# EAGLE schematic matrixblock (EAGLE 6.4)
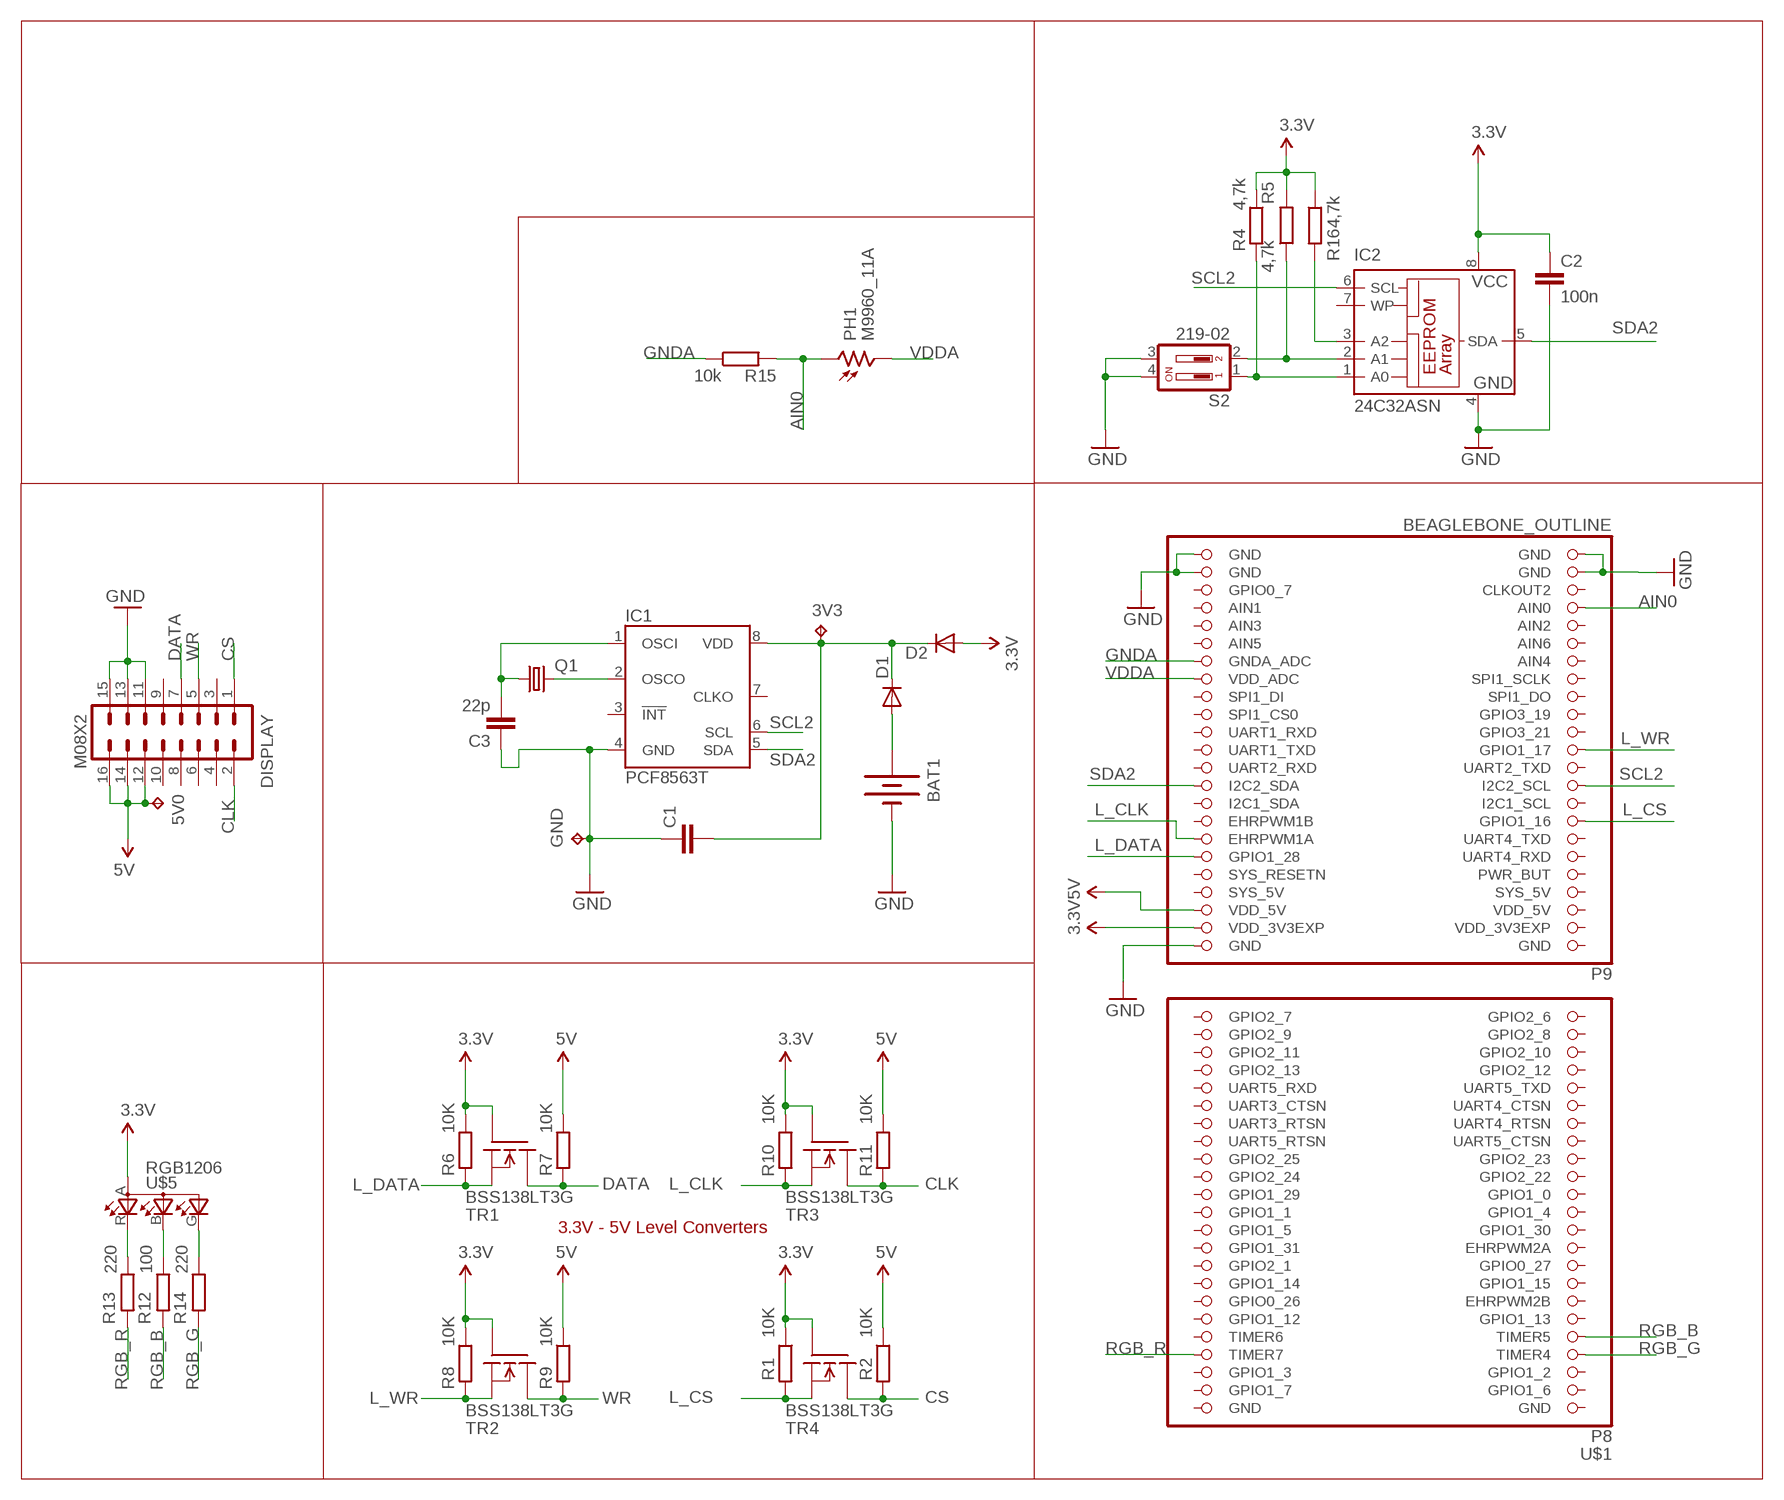
[diagram p0: schematic, sheet 1]

## Parts
3V3  TPTP20R  [TP20R]
5V0  TPTP20R  [TP20R]
BAT1  BATTERY20PTH  [BATTCOM_20MM_PTH]
C1  C-EUC0805  [C0805]
C2  100n  C-EUC0805  [C0805]
C3  22p  C-EUC0805  [C0805]
D1  DIODEHV  [DIODE-HV]
D2  DIODEHV  [DIODE-HV]
DISPLAY  M08X2  [2X8]
GND  TPTP20R  [TP20R]
IC1  PCF8563T  [SO8]
IC2  24C32ASN  [SO-08]
PH1  M9960_11A  [M9960]
Q1  CRYSTALTC26H  [TC26H]
R1  10K  R-EU_R0805  [R0805]
R2  10K  R-EU_R0805  [R0805]
R4  4,7k  R-EU_R0805  [R0805]
R5  4,7k  R-EU_R0805  [R0805]
R6  10K  R-EU_R0805  [R0805]
R7  10K  R-EU_R0805  [R0805]
R8  10K  R-EU_R0805  [R0805]
R9  10K  R-EU_R0805  [R0805]
R10  10K  R-EU_R0805  [R0805]
R11  10K  R-EU_R0805  [R0805]
R12  100  R-EU_R0805  [R0805]
R13  220  R-EU_R0805  [R0805]
R14  220  R-EU_R0805  [R0805]
R15  10k  R-EU_R0805  [R0805]
R16  4,7k  R-EU_R0805  [R0805]
S2  219-02  [CTS-219-02]
TR1  BSS138LT3G  IRLML2502PBF  [SOT23]
TR2  BSS138LT3G  IRLML2502PBF  [SOT23]
TR3  BSS138LT3G  IRLML2502PBF  [SOT23]
TR4  BSS138LT3G  IRLML2502PBF  [SOT23]
U$1  BEAGLEBONE_OUTLINE  [BEAGLEBONE_SHIELD]
U$5  RGB1206  [RGB1206]

## Nets
3.3V: D2.A R1.1 R6.1 R8.1 R10.1 TR1.1(G) TR2.1(G) TR3.1(G) TR4.1(G) U$1.50(VDD_3V3EXP) U$5.A
5V: 5V0.TP DISPLAY.12 DISPLAY.14 DISPLAY.16 R2.1 R7.1 R9.1 R11.1 U$1.52(VDD_5V)
AIN0: PH1.1 R15.2 U$1.85(AIN0)
CLK: DISPLAY.2 R11.2 TR3.3(D)
CS: DISPLAY.1 R2.2 TR4.3(D)
DATA: DISPLAY.7 R7.2 TR1.3(D)
GND: BAT1.2(-) C1.1 C2.2 C3.1 DISPLAY.11 DISPLAY.13 DISPLAY.15 GND.TP IC1.4(GND) IC2.4(GND) S2.3 S2.4 U$1.48(GND) U$1.89(GND) U$1.90(GND) U$1.91(GND) U$1.92(GND)
GNDA: R15.1 U$1.80(GNDA_ADC)
L_CLK: R10.2 TR3.2(S) U$1.60(EHRPWM1A)
L_CS: R1.2 TR4.2(S) U$1.61(GPIO1_16)
L_DATA: R6.2 TR1.2(S) U$1.58(GPIO1_28)
L_WR: R8.2 TR2.2(S) U$1.69(GPIO1_17)
N$1: BAT1.1(+) D1.A
N$2: R12.1 U$5.B(CBLUE)
N$3: IC1.2(OSCO) Q1.2
N$4: C3.2 IC1.1(OSCI) Q1.1
N$6: R13.1 U$5.R(CRED)
N$7: 3V3.TP C1.2 D1.C D2.C IC1.8(VDD)
N$8: R14.1 U$5.G(CGREEN)
N$9 [power]: IC2.3(A2) R16.2
N$38: IC2.2(A1) R5.1 S2.2
N$39: IC2.1(A0) R4.2 S2.1
RGB_B: R12.2 U$1.9(TIMER5)
RGB_G: R14.2 U$1.7(TIMER4)
RGB_R: R13.2 U$1.8(TIMER7)
SCL2: IC1.6(SCL) IC2.6(SCL) U$1.65(I2C2_SCL)
SDA2: IC1.5(SDA) IC2.5(SDA) U$1.66(I2C2_SDA)
VCC [power]: C2.1 IC2.8(VCC) R4.1 R5.2 R16.1 ; supply symbol labelled 3.3V
VDDA: PH1.2 U$1.78(VDD_ADC)
WR: DISPLAY.5 R9.2 TR2.3(D)
Unconnected: DISPLAY.3 DISPLAY.4 DISPLAY.6 DISPLAY.8 DISPLAY.9 DISPLAY.10 IC1.3(!INT) IC1.7(CLKO) IC2.7(WP) U$1.3(GPIO1_6) U$1.4(GPIO1_7) U$1.5(GPIO1_2) U$1.6(GPIO1_3) U$1.10(TIMER6) U$1.11(GPIO1_13) U$1.12(GPIO1_12) U$1.13(EHRPWM2B) U$1.14(GPIO0_26) U$1.15(GPIO1_15) U$1.16(GPIO1_14) U$1.17(GPIO0_27) U$1.18(GPIO2_1) U$1.19(EHRPWM2A) U$1.20(GPIO1_31) U$1.21(GPIO1_30) U$1.22(GPIO1_5) U$1.23(GPIO1_4) U$1.24(GPIO1_1) U$1.25(GPIO1_0) U$1.26(GPIO1_29) U$1.27(GPIO2_22) U$1.28(GPIO2_24) U$1.29(GPIO2_23) U$1.30(GPIO2_25) U$1.31(UART5_CTSN) U$1.32(UART5_RTSN) U$1.33(UART4_RTSN) U$1.34(UART3_RTSN) U$1.35(UART4_CTSN) U$1.36(UART3_CTSN) U$1.37(UART5_TXD) U$1.38(UART5_RXD) U$1.39(GPIO2_12) U$1.40(GPIO2_13) U$1.41(GPIO2_10) U$1.42(GPIO2_11) U$1.43(GPIO2_8) U$1.44(GPIO2_9) U$1.45(GPIO2_6) U$1.46(GPIO2_7) U$1.54(SYS_5V) U$1.55(PWR_BUT) U$1.56(SYS_RESETN) U$1.57(UART4_RXD) U$1.59(UART4_TXD) U$1.62(EHRPWM1B) U$1.63(I2C1_SCL) U$1.64(I2C1_SDA) U$1.67(UART2_TXD) U$1.68(UART2_RXD) U$1.70(UART1_TXD) U$1.71(GPIO3_21) U$1.72(UART1_RXD) U$1.73(GPIO3_19) U$1.74(SPI1_CS0) U$1.75(SPI1_DO) U$1.76(SPI1_DI) U$1.77(SPI1_SCLK) U$1.79(AIN4) U$1.81(AIN6) U$1.82(AIN5) U$1.83(AIN2) U$1.84(AIN3) U$1.86(AIN1) U$1.87(CLKOUT2) U$1.88(GPIO0_7)

## Notes on the sheet
- 3.3V - 5V Level Converters

## Power pins joined to a net without a drawn wire
GND: U$1.1(GND) U$1.2(GND) U$1.47(GND)
SYS_5V: U$1.53(SYS_5V)
VDD_3V3EXP: U$1.49(VDD_3V3EXP)
VDD_5V: U$1.51(VDD_5V)

## Library data of the parts
3V3 5V0 GND = testpad:TP: Test pad
BAT1 = SparkFun-Electromechanical:BATTERY: Battery Holders Various common sizes : AA, AAA, 20mm coin cell and 12mm coin cell. 20MM_4LEGS, BATT-10373
C1-C3 = resistor:C-EU: CAPACITOR, European symbol
D1 D2 = SparkFun-DiscreteSemi:DIODE: Diode These are standard reverse protection diodes and small signal diodes. SMA package can handle up to about 1A. SOD-323 can handle about 200mA. What the SOD-323 package when ordering, there are some mfgs out there that are 5-pin packages.
DISPLAY = SparkFun-Connectors:M08X2: .1" headers, two rows of 8 each
IC1 = micro-philips:PCF8563: I2C-Bus CLOCK/CALENDAR Source : http://www.datasheetcatalog.org/datasheet/philips/PCF8563-02.pdf
IC2 = microchip:24*: Serial EEPROM I2C; MPN: IS24C32A-2GLI; OC_FARNELL: 1224413; OC_NEWARK: 43M4588
PH1 = photo-elements:M9960_11: Photo Sensor Beacon Light, Photometer Applications Source: http://optoelectronics.perkinelmer.com/content/Datasheets/DTS_M9960.pdf
Q1 = crystal:CRYSTAL: CRYSTAL; OC_FARNELL: unknown; OC_NEWARK: unknown
R1 R2 R4-R16 = resistor:R-EU_: RESISTOR, European symbol
S2 = switch-dil:219-02*: Surface Mount DIP Switch Series 219 SMT CTS Electronic Components Sourc: www.ctscorp.com; OC_FARNELL: unknown; OC_NEWARK: unknown
TR1-TR4 = Monkey:IRLML2502PBF: IRLML2502 N-Channel HexFet Power Mosfet Datasheet : http://www.irf.com/product-info/datasheets/data/irlml2502pbf.pdf
U$1 = adafruit:BEAGLEBONE_OUTLINE: Should match A3 pinout - but not completely tested
U$5 = artek:RGB1206: Dioda RGB 1206

## Net classes
0 default: width 0.305 mm
1 power: width 0.305 mm